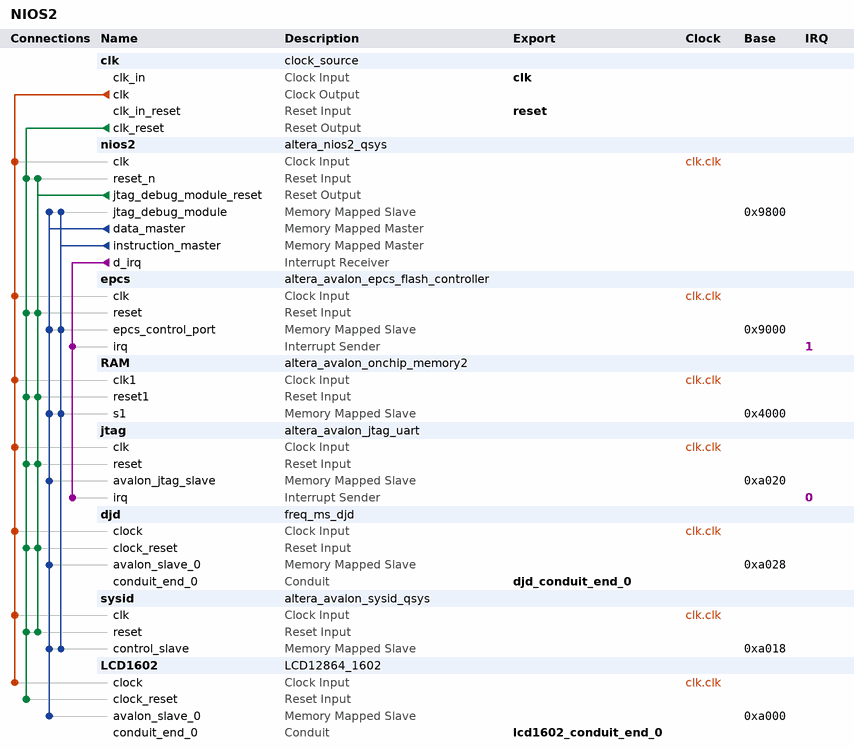
[diagram p0: system contents]
# Platform Designer (Qsys) system NIOS2, Cyclone II EP2C8Q208C8
# Parameters at their usual value, and those the tool derives, are not listed.
package require -exact qsys 13.0
create_system NIOS2
set_project_property DEVICE_FAMILY {Cyclone II}
set_project_property DEVICE EP2C8Q208C8

add_instance clk clock_source 13.0
set_instance_parameter_value clk clockFrequency 100000000

add_instance nios2 altera_nios2_qsys 13.0
set_instance_parameter_value nios2 resetSlave epcs.epcs_control_port
set_instance_parameter_value nios2 mmu_TLBMissExcSlave None
set_instance_parameter_value nios2 exceptionSlave RAM.s1
set_instance_parameter_value nios2 breakSlave nios2.jtag_debug_module
set_instance_parameter_value nios2 impl Tiny
set_instance_parameter_value nios2 icache_size 4096

add_instance epcs altera_avalon_epcs_flash_controller 13.0.1

add_instance RAM altera_avalon_onchip_memory2 13.0.1
set_instance_parameter_value RAM dataWidth 32
set_instance_parameter_value RAM dualPort false
set_instance_parameter_value RAM initMemContent true
set_instance_parameter_value RAM initializationFileName onchip_mem.hex
set_instance_parameter_value RAM memorySize 12288

add_instance jtag altera_avalon_jtag_uart 13.0.1
set_instance_parameter_value jtag simInteractiveOptions NO_INTERACTIVE_WINDOWS

add_instance djd freq_ms_djd 1.0

add_instance sysid altera_avalon_sysid_qsys 13.0
set_instance_parameter_value sysid id 40976

add_instance LCD1602 LCD12864_1602 1.0

# connections
add_connection clk.clk djd.clock clock
add_connection clk.clk epcs.clk clock
add_connection clk.clk jtag.clk clock
add_connection clk.clk LCD1602.clock clock
add_connection clk.clk nios2.clk clock
add_connection clk.clk RAM.clk1 clock
add_connection clk.clk sysid.clk clock
add_connection clk.clk_reset djd.clock_reset reset
add_connection clk.clk_reset epcs.reset reset
add_connection clk.clk_reset jtag.reset reset
add_connection clk.clk_reset LCD1602.clock_reset reset
add_connection clk.clk_reset nios2.reset_n reset
add_connection clk.clk_reset RAM.reset1 reset
add_connection clk.clk_reset sysid.reset reset
add_connection nios2.jtag_debug_module_reset djd.clock_reset reset
add_connection nios2.jtag_debug_module_reset epcs.reset reset
add_connection nios2.jtag_debug_module_reset jtag.reset reset
add_connection nios2.jtag_debug_module_reset nios2.reset_n reset
add_connection nios2.jtag_debug_module_reset RAM.reset1 reset
add_connection nios2.jtag_debug_module_reset sysid.reset reset
add_connection nios2.data_master djd.avalon_slave_0 avalon
set_connection_parameter_value nios2.data_master/djd.avalon_slave_0 baseAddress 0xa028
add_connection nios2.data_master epcs.epcs_control_port avalon
set_connection_parameter_value nios2.data_master/epcs.epcs_control_port baseAddress 0x9000
add_connection nios2.data_master jtag.avalon_jtag_slave avalon
set_connection_parameter_value nios2.data_master/jtag.avalon_jtag_slave baseAddress 0xa020
add_connection nios2.data_master LCD1602.avalon_slave_0 avalon
set_connection_parameter_value nios2.data_master/LCD1602.avalon_slave_0 baseAddress 0xa000
add_connection nios2.data_master nios2.jtag_debug_module avalon
set_connection_parameter_value nios2.data_master/nios2.jtag_debug_module baseAddress 0x9800
add_connection nios2.data_master RAM.s1 avalon
set_connection_parameter_value nios2.data_master/RAM.s1 baseAddress 0x4000
add_connection nios2.data_master sysid.control_slave avalon
set_connection_parameter_value nios2.data_master/sysid.control_slave baseAddress 0xa018
add_connection nios2.instruction_master epcs.epcs_control_port avalon
set_connection_parameter_value nios2.instruction_master/epcs.epcs_control_port baseAddress 0x9000
add_connection nios2.instruction_master nios2.jtag_debug_module avalon
set_connection_parameter_value nios2.instruction_master/nios2.jtag_debug_module baseAddress 0x9800
add_connection nios2.instruction_master RAM.s1 avalon
set_connection_parameter_value nios2.instruction_master/RAM.s1 baseAddress 0x4000
add_connection nios2.instruction_master sysid.control_slave avalon
set_connection_parameter_value nios2.instruction_master/sysid.control_slave baseAddress 0xa018
add_connection nios2.d_irq epcs.irq interrupt
set_connection_parameter_value nios2.d_irq/epcs.irq irqNumber 1
add_connection nios2.d_irq jtag.irq interrupt
set_connection_parameter_value nios2.d_irq/jtag.irq irqNumber 0

# exported interfaces
add_interface clk clock sink
set_interface_property clk EXPORT_OF clk.clk_in
add_interface reset reset sink
set_interface_property reset EXPORT_OF clk.clk_in_reset
add_interface djd_conduit_end_0 conduit end
set_interface_property djd_conduit_end_0 EXPORT_OF djd.conduit_end_0
add_interface lcd1602_conduit_end_0 conduit end
set_interface_property lcd1602_conduit_end_0 EXPORT_OF LCD1602.conduit_end_0

set_interconnect_requirement {$system} qsys_mm.clockCrossingAdapter HANDSHAKE
set_interconnect_requirement {$system} qsys_mm.maxAdditionalLatency 1

save_system NIOS2.qsys
